# EAGLE design smogbusters (EAGLE 9.2.2)
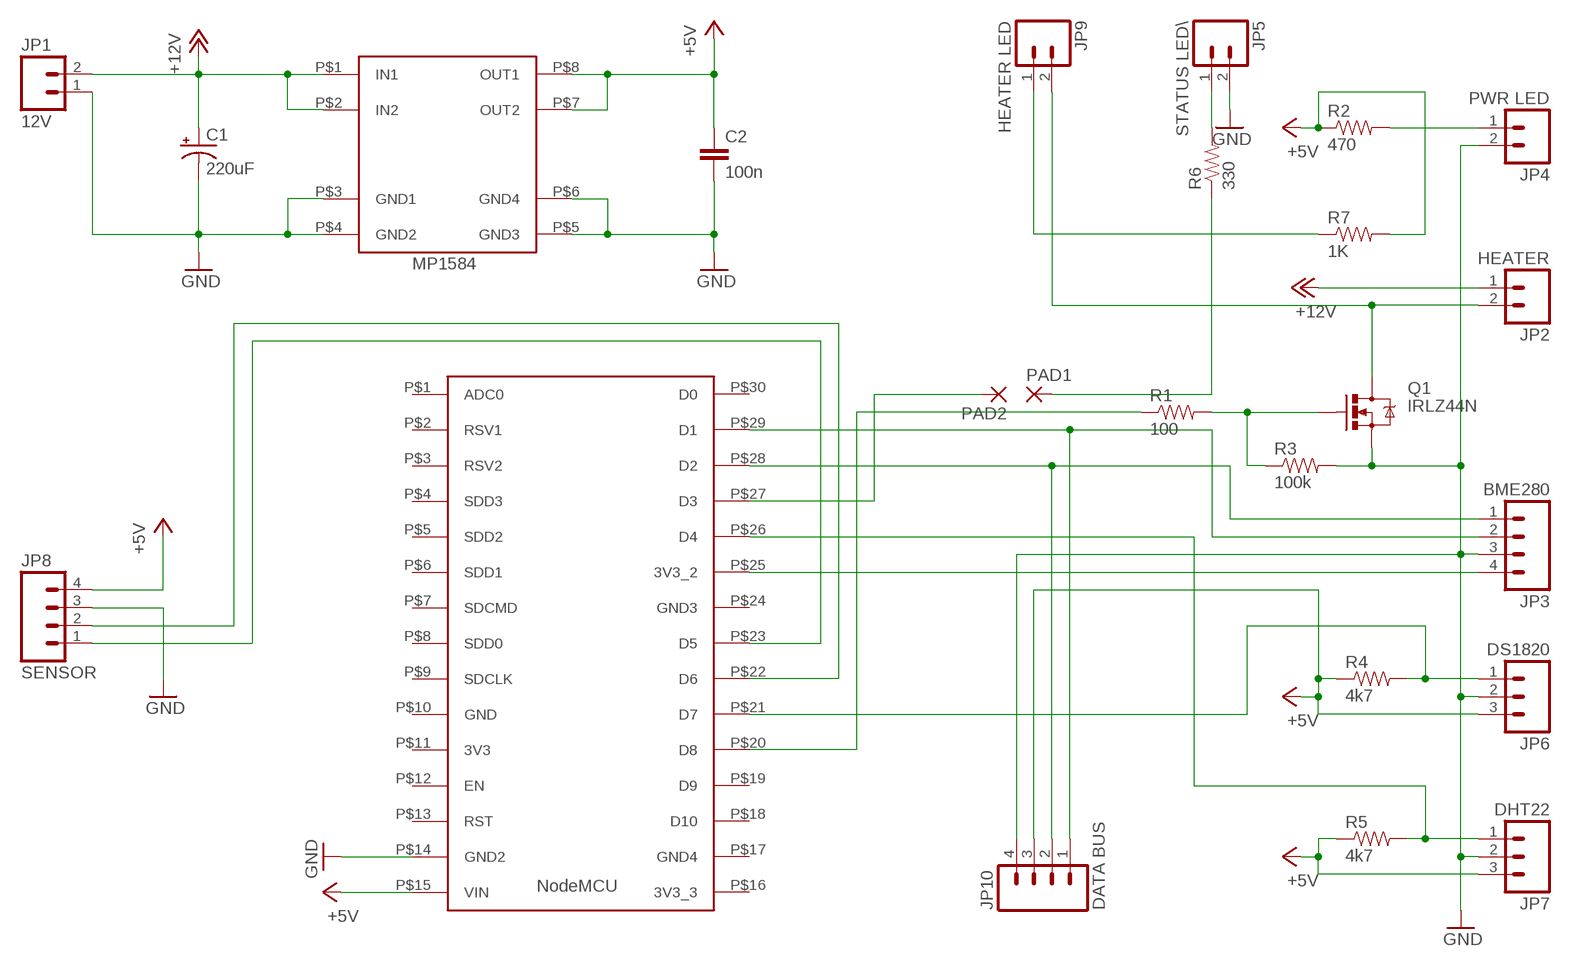
[diagram p0: schematic, sheet 1]

## Parts
C1  220uF  CAP_POLPTH1  [CPOL-RADIAL-100UF-25V]
C2  100n  C5/2.5  [C5B2.5]
JP1  12V  M025MM  [SCREWTERMINAL-5MM-2]
JP2  HEATER  M025MM  [SCREWTERMINAL-5MM-2]
JP3  BME280  M04PTH  [1X04]
JP4  PWR LED  M02PTH  [1X02]
JP5  STATUS LED\  M02PTH  [1X02]
JP6  DS1820  M03PTH  [1X03]
JP7  DHT22  M03PTH  [1X03]
JP8  SENSOR  M04POLAR  [MOLEX-1X4]
JP9  HEATER LED  M02PTH  [1X02]
JP10  DATA BUS  M04PTH  [1X04]
PAD1  1,6/0,8  [1,6/0,8]
PAD2  1,6/0,8  [1,6/0,8]
Q1  IRLZ44N  MOSFET-NCHANNELFQP30N06L  [TO220V]
R1  100  1KOHM-1/4W-1%(PTH)  [AXIAL-0.3]
R2  470  1KOHM-1/4W-1%(PTH)  [AXIAL-0.3]
R3  100k  1KOHM-1/4W-1%(PTH)  [AXIAL-0.3]
R4  4k7  1KOHM-1/4W-1%(PTH)  [AXIAL-0.3]
R5  4k7  1KOHM-1/4W-1%(PTH)  [AXIAL-0.3]
R6  330  1KOHM-1/4W-1%(PTH)  [AXIAL-0.3]
R7  1K  1KOHM-1/4W-1%(PTH)  [AXIAL-0.3]
U$1  NODEMCU  [NODEMCU]
U$2  MP1584  [MP1584]

## Nets
+5V: C2.1 JP6.3 JP7.3 JP8.4 JP10.3 R2.P$1 R4.P$1 R5.P$1 R7.P$2 U$1.P$15(VIN) U$2.P$7(OUT2) U$2.P$8(OUT1)
+12V: C1.1(+) JP1.2 JP2.1 U$2.P$1(IN1) U$2.P$2(IN2)
GND: C1.2(-) C2.2 JP1.1 JP3.3 JP4.2 JP5.2 JP6.2 JP7.2 JP8.3 JP10.4 Q1.3(S) R3.P$2 U$1.P$14(GND2) U$2.P$3(GND1) U$2.P$4(GND2) U$2.P$5(GND3) U$2.P$6(GND4)
N$1: JP2.2 JP9.2 Q1.2(D)
N$2: JP6.1 R4.P$2 U$1.P$21(D7)
N$3: Q1.1(G) R1.P$2 R3.P$1
N$4: JP5.1 R6.P$2
N$5: JP3.4 U$1.P$25(3V3_2)
N$6: JP8.1 U$1.P$23(D5)
N$7: JP8.2 U$1.P$22(D6)
N$8: R1.P$1 U$1.P$20(D8)
N$9: JP7.1 R5.P$2 U$1.P$26(D4)
N$12: PAD1.1(P) R6.P$1
N$13: JP9.1 R7.P$1
N$14: PAD2.1(P) U$1.P$27(D3)
N$15: JP4.1 R2.P$2
N$16: JP3.1 JP10.2 U$1.P$28(D2)
N$17: JP3.2 JP10.1 U$1.P$29(D1)
Unconnected: U$1.P$1(ADC0) U$1.P$2(RSV1) U$1.P$3(RSV2) U$1.P$4(SDD3) U$1.P$5(SDD2) U$1.P$6(SDD1) U$1.P$7(SDCMD) U$1.P$8(SDD0) U$1.P$9(SDCLK) U$1.P$10(GND) U$1.P$11(3V3) U$1.P$12(EN) U$1.P$13(RST) U$1.P$16(3V3_3) U$1.P$17(GND4) U$1.P$18(D10) U$1.P$19(D9) U$1.P$24(GND3) U$1.P$30(D0)

## Library data of the parts
C1 = SparkFun-Capacitors:CAP_POL: Capacitor Polarized These are standard SMD and PTH capacitors. Normally 10uF, 47uF, and 100uF in electrolytic and tantalum varieties. Always verify the external diameter of the through hole cap, it varies with capacity, voltage, and manufacturer. The EIA devices should be standard.
C2 = capacitor-wima:C: CAPACITOR naming: grid - package width
JP1 JP2 = SparkFun-Connectors:M02: Standard 2-pin 0.1" header. Use with - straight break away headers ( PRT-00116) - right angle break away headers (PRT-00553) - swiss pins (PRT-00743) - machine pins (PRT-00117) - female headers (PRT-00115) Molex polarized connector foot print use with: PRT-08233 with associated crimp pins and housings. 2.54_SCREWTERM for use with PRT-10571. 3.5mm Screw Terminal footprints for PRT-08084 5mm Screw Terminal footprints for use with PRT-08432; STOREFRONT_ID: PRT-08432
JP3 JP8 JP10 = SparkFun-Connectors:M04: Header 4 Standard 4-pin 0.1" header. Use with straight break away headers (SKU : PRT-00116), right angle break away headers (PRT-00553), swiss pins (PRT-00743), machine pins (PRT-00117), and female headers (PRT-00115). Molex polarized connector foot print use with SKU : PRT-08231 with associated crimp pins and housings. 1MM SMD Version SKU: PRT-10208
JP4 JP5 JP9 = SparkFun-Connectors:M02: Standard 2-pin 0.1" header. Use with - straight break away headers ( PRT-00116) - right angle break away headers (PRT-00553) - swiss pins (PRT-00743) - machine pins (PRT-00117) - female headers (PRT-00115) Molex polarized connector foot print use with: PRT-08233 with associated crimp pins and housings. 2.54_SCREWTERM for use with PRT-10571. 3.5mm Screw Terminal footprints for PRT-08084 5mm Screw Terminal footprints for use with PRT-08432
JP6 JP7 = SparkFun-Connectors:M03: Header 3 Standard 3-pin 0.1" header. Use with straight break away headers (SKU : PRT-00116), right angle break away headers (PRT-00553), swiss pins (PRT-00743), machine pins (PRT-00117), and female headers (PRT-00115). Molex polarized connector foot print use with SKU : PRT-08232 with associated crimp pins and housings.
PAD1 PAD2 = wirepad:1,6/0,8: THROUGH-HOLE PAD
Q1 = SparkFun-DiscreteSemi:MOSFET-NCHANNEL: Common NMOSFET Parts MFG P/N Store ID Prod ID FDD8780 TRANS-09984 SI7820DN TRANS-11055 FDS6630A IC-08089 2N7002PW TRANS-11151 FQP30N06L COM-10213 TRANS-10060 BSS123LT1G TRANS-08345 BSS138 TRANS-00830 BS170 2N7000; PROD_ID: TRANS-10060
R1-R6 = SparkFun-Resistors:1KOHM-1/4W-1%(PTH): RES-12182; PROD_ID: RES-12182; VALUE: 1K
R7 = SparkFun-Resistors:1KOHM-1/4W-1%(PTH): RES-12182; PROD_ID: RES-12182
U$1 = astrojolo:NODEMCU
U$2 = astrojolo:MP1584

## Board
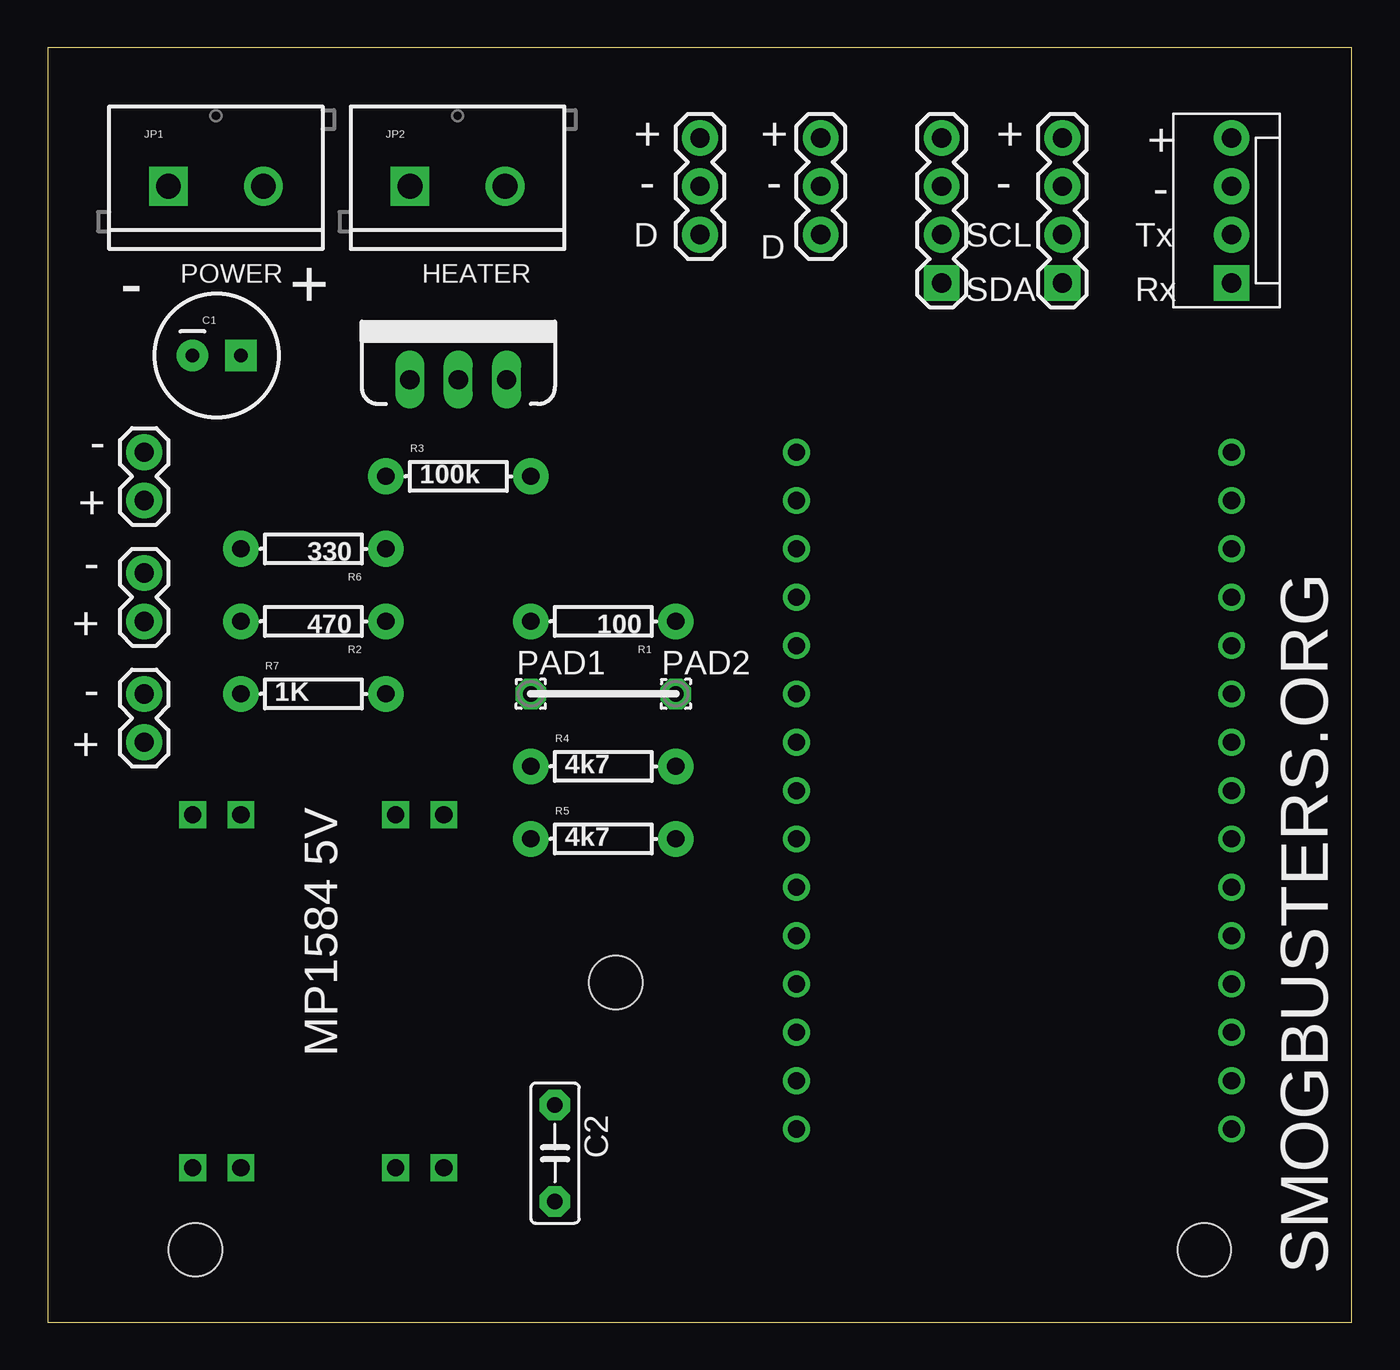
[diagram p1: board, top side]
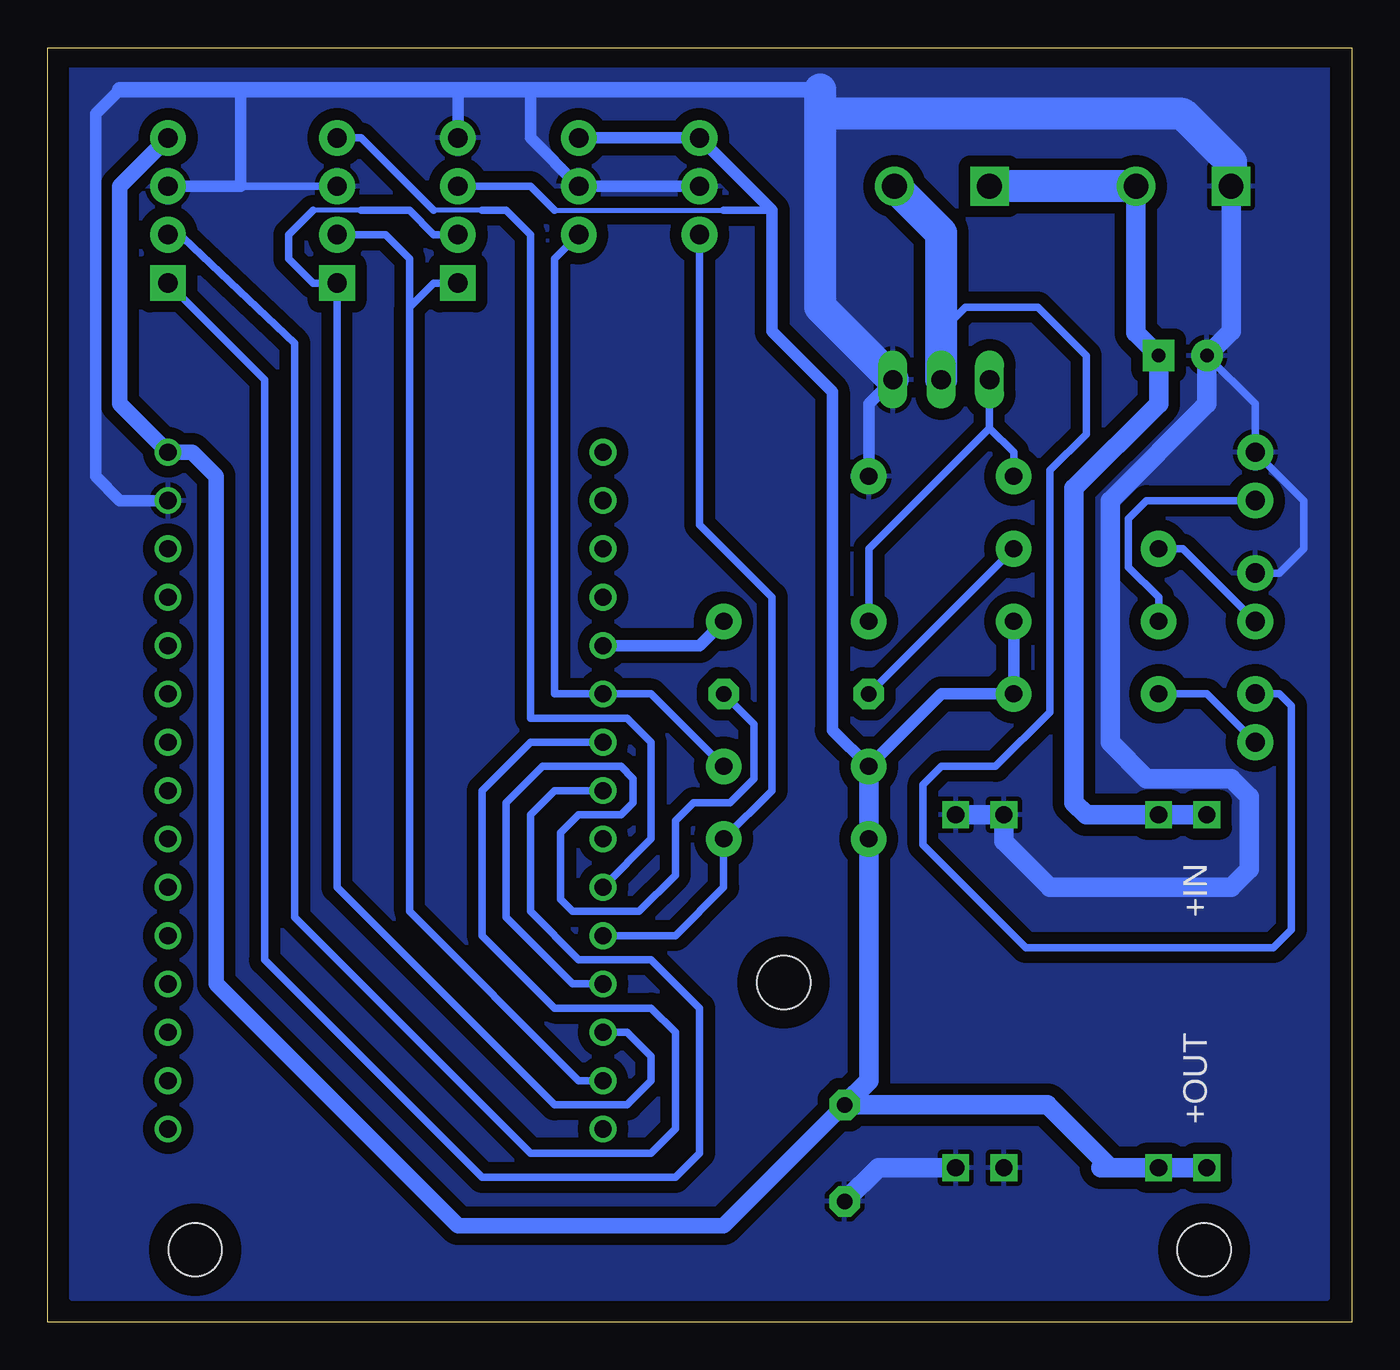
[diagram p2: board, bottom side, seen from below]

Size 68.56 x 66.98 mm. Coordinates in mm from the lower left corner, seen from the top.
Outline: 0,0 68.56,0 68.56,66.98 0,66.98 0,0
Copper layers 16: Bottom 0.035mm
Design rules "default *": minimum track width 10mil, minimum drill 24mil, track to track 8mil, track to pad 8mil, pad to pad 8mil, via to via 8mil, smd to smd 8mil, copper to edge 40mil, drill to drill 8mil, minimum pad ring 10mil, minimum via ring 8mil, stop-mask expansion 4mil, vias tented up to drill 0mil, thermal gap 10mil
Holes 2.8 mm at 7.77,3.81 29.87,17.86 60.81,3.81

### Footprints (pad centres in the part's own frame; a part is rotated, then mirrored left to right if it is on the bottom)
CPOL-RADIAL-100UF-25V = drill 0.7 pad 1.651 square: 1 1.27,0 | drill 0.7 pad 1.651: 2 -1.27,0
C5B2.5 = drill 0.813 pad 1.6 octagon: 1 -2.54,0; 2 2.54,0
SCREWTERMINAL-5MM-2 = drill 1.3 pad 2.032 square: 1 0,0 | drill 1.3 pad 2.032: 2 5,0
1X04 = drill 1.016 pad 1.88 square: 1 0,0 | drill 1.016 pad 1.88: 2 2.54,0; 3 5.08,0; 4 7.62,0
1X02 = drill 1.016 pad 1.88: 1 0,0; 2 2.54,0
1X03 = drill 1.016 pad 1.88: 1 0,0; 2 2.54,0; 3 5.08,0
MOLEX-1X4 = drill 1.016 pad 1.88 square: 1 0,0 | drill 1.016 pad 1.88: 2 2.54,0; 3 5.08,0; 4 7.62,0
1,6/0,8 = drill 0.813 pad 1.6 octagon: 1 0,0
TO220V = drill 1.016 long: 1 -2.54,0; 2 0,0; 3 2.54,0
AXIAL-0.3 = drill 0.9 pad 1.88: P$1 -3.81,0; P$2 3.81,0
NODEMCU = drill 0.9: P$1 -10.16,11.43; P$2 -10.16,8.89; P$3 -10.16,6.35; P$4 -10.16,3.81; P$5 -10.16,1.27; P$6 -10.16,-1.27; P$7 -10.16,-3.81; P$8 -10.16,-6.35; P$9 -10.16,-8.89; P$10 -10.16,-11.43; P$11 -10.16,-13.97; P$12 -10.16,-16.51; P$13 -10.16,-19.05; P$14 -10.16,-21.59; P$15 -10.16,-24.13; P$16 12.7,-24.13; P$17 12.7,-21.59; P$18 12.7,-19.05; P$19 12.7,-16.51; P$20 12.7,-13.97; P$21 12.7,-11.43; P$22 12.7,-8.89; P$23 12.7,-6.35; P$24 12.7,-3.81; P$25 12.7,-1.27; P$26 12.7,1.27; P$27 12.7,3.81; P$28 12.7,6.35; P$29 12.7,8.89; P$30 12.7,11.43
MP1584 = drill 0.9 square: P$1 0,0; P$2 0,-2.54; P$3 0,-10.668; P$4 0,-13.208; P$5 18.542,-13.208; P$6 18.542,-10.668; P$7 18.542,-2.54; P$8 18.542,0

### Placement (x,y rotation side)
C1  8.89,50.8 0 top
C2  26.67,8.89 270 top
JP1  6.35,59.69 0 top
JP2  19.05,59.69 0 top
JP3  53.34,54.61 90 top
JP4  5.08,43.18 90 top
JP5  5.08,36.83 90 top
JP6  40.64,57.15 90 top
JP7  34.29,57.15 90 top
JP8  62.23,54.61 90 top
JP9  5.08,30.48 90 top
JP10  46.99,54.61 90 top
PAD1  25.4,33.02 0 top
PAD2  33.02,33.02 0 top
Q1  21.59,49.53 0 top
R1  29.21,36.83 180 top
R2  13.97,36.83 180 top
R3  21.59,44.45 0 top
R4  29.21,29.21 0 top
R5  29.21,25.4 0 top
R6  13.97,40.64 180 top
R7  13.97,33.02 0 top
U$1  52.07,21.59 180 top
U$2  7.62,26.67 270 bottom

### Tracks (layer width: path | path; a pad name or v marks a point on that pad's centre or on a via)
+5V
  Bottom 0.254: 41.91,58.42 33.02,58.42
  Bottom 0.406: 41.91,58.42 43.18,59.69 JP10.3 | 33.02,58.42 30.48,58.42
  Bottom 0.61: JP6.3 JP7.3 30.48,58.42 30.48,52.07 27.3,48.9 27.3,31.11 R4.P$1 21.59,33.02 R7.P$2 | R7.P$2 19.05,33.02 | R7.P$2 R2.P$1
  Bottom 0.813: JP8.4 64.77,59.69 64.77,48.26 U$1.P$15 60.96,45.72 59.69,44.45 59.69,17.78 54.61,12.7 46.99,5.08 33.02,5.08 C2.1
  Bottom 1.016: R5.P$1 R4.P$1 | U$2.P$8 U$2.P$7 12.7,8.13 | R5.P$1 25.4,24.13 | 12.7,8.13 13.21,8.13 | R5.P$1 25.4,12.7 C2.1 16,11.43 12.7,8.13
+12V
  Bottom 1.016: JP1.2 11.35,51.99 C1.1 10.16,48.26 14.61,43.82 14.61,27.3 13.97,26.67 U$2.P$2 U$2.P$1
  Bottom 1.676: JP1.2 JP2.1
GND
  Bottom 0.406: C1.2 5.08,48.26 JP4.2 2.54,43.18 2.54,40.64 3.81,39.37 JP5.2 | JP3.3 58.42,59.69
  Bottom 0.61: U$1.P$14 64.77,43.18 66.04,44.45 66.04,63.5 64.77,64.77 | JP7.2 JP6.2 43.18,62.23 43.18,64.77 | JP8.3 58.42,59.69 58.42,64.77 | Q1.3 25.4,48.26 R3.P$2 | JP10.4 46.99,64.77
  Bottom 0.813: 64.77,64.77 58.42,64.77 46.99,64.77 43.18,64.77 27.94,64.77
  Bottom 1.016: JP1.1 6.35,52.07 C1.2 7.62,48.26 12.7,43.18 12.7,30.48 10.79,28.57 6.35,28.57 5.4,27.62 5.4,23.81 6.35,22.86 15.88,22.86 18.29,25.27 U$2.P$3 U$2.P$4 | U$2.P$5 24.89,8.13 C2.2
  Bottom 1.676: JP1.1 6.35,60.96 8.89,63.5 27.94,63.5 | Q1.3 27.94,53.34 27.94,63.5 | 27.94,63.5 27.94,64.77
  pour Bottom (isolate 0.61): 1.27,66.04 67.31,66.04 67.31,1.27 1.27,1.27
N$1
  Bottom 0.406: JP9.2 3.81,33.02 3.17,32.38 3.17,20.64 4.13,19.68 17.14,19.68 22.54,25.08 22.54,28.26 21.59,29.21 18.73,29.21 15.88,32.07 15.88,44.77 13.97,46.67 13.97,50.8 16.51,53.34 20.32,53.34 21.59,52.07
  Bottom 1.676: Q1.2 21.59,52.07 21.59,57.23 JP2.2
N$2
  Bottom 0.406: R4.P$2 36.83,33.02 U$1.P$21 41.91,33.02 41.91,55.88 JP6.1
N$3
  Bottom 0.406: 19.05,46.99 25.4,40.64 R1.P$2 | 19.05,46.99 Q1.1 | R3.P$1 17.78,45.72 19.05,46.99
N$4
  Bottom 0.406: JP5.1 8.89,40.64 R6.P$2
N$5
  Bottom 0.254: 45.72,58.42 48.26,58.42
  Bottom 0.406: U$1.P$25 36.83,25.4 36.83,30.48 38.1,31.75 43.18,31.75 43.18,57.15 44.45,58.42 45.72,58.42 | 48.26,58.42 52.07,62.23 JP3.4
N$6
  Bottom 0.406: JP8.1 57.15,49.53 57.15,19.05 45.72,7.62 35.56,7.62 34.29,8.89 34.29,16.51 36.83,19.05 40.64,19.05 43.18,21.59 43.18,26.67 41.91,27.94 U$1.P$23
N$7
  Bottom 0.406: U$1.P$22 43.18,30.48 45.72,27.94 45.72,20.32 41.91,16.51 36.83,16.51 35.56,15.24 35.56,10.16 36.83,8.89 43.18,8.89 55.56,21.27 55.56,51.44 61.92,57.46
  Bottom 0.61: 61.92,57.46 JP8.2
N$8
  Bottom 0.61: R1.P$1 34.29,35.56 U$1.P$20
N$9
  Bottom 0.406: U$1.P$26 35.56,20.32 33.02,22.86 R5.P$2 30.48,27.94 30.48,38.1 34.29,41.91 JP7.1
N$12
  Bottom 0.406: R6.P$1 PAD1.1
N$13
  Bottom 0.406: JP9.1 7.62,33.02 R7.P$1
N$14
  Bottom 0.406: U$1.P$27 40.96,17.78 44.45,21.27 44.45,27.3 42.55,29.21 38.42,29.21 37.78,28.57 37.78,27.3 38.42,26.67 40.64,26.67 41.59,25.72 41.59,22.22 40.96,21.59 37.47,21.59 35.56,23.5 35.56,26.35 34.61,27.3 32.7,27.3 31.43,28.57 31.43,31.43 PAD2.1
N$15
  Bottom 0.406: R2.P$2 10.16,38.1 11.75,39.69 11.75,42.23 10.79,43.18 JP4.1
N$16
  Bottom 0.254: 52.07,58.42 54.61,58.42
  Bottom 0.406: U$1.P$28 38.1,15.24 36.83,13.97 36.83,12.7 38.1,11.43 41.91,11.43 53.34,22.86 JP3.1 54.61,54.61 55.88,55.88 55.88,57.15 54.61,58.42 | JP10.2 48.26,57.15 49.53,58.42 52.07,58.42
N$17
  Bottom 0.406: U$1.P$29 40.64,12.7 49.53,21.59 49.53,53.34 | 49.53,53.34 48.26,54.61 JP10.1 | JP3.2 50.8,57.15 49.53,55.88 49.53,53.34

### Text on the board
tNames: + | + | + | + | - | - | - | - | D | D | SCL | Tx | POWER | HEATER | - | + | SDA | Rx | GND | - | + | - | SMOGBUSTERS.ORG | + | +5V | - | + | MP1584 5V